# Altium schematic sheet 301_FrameUSB.SchDoc: Framework USB Expansion Ports
size A2; Organization: Greenfield Tech Solutions; Address1: Molendreef 33; Address2: Ossendrecht; Address3: 4641CS; Address4: The Netherlands; SheetNumber: 4; SheetTotal: 9
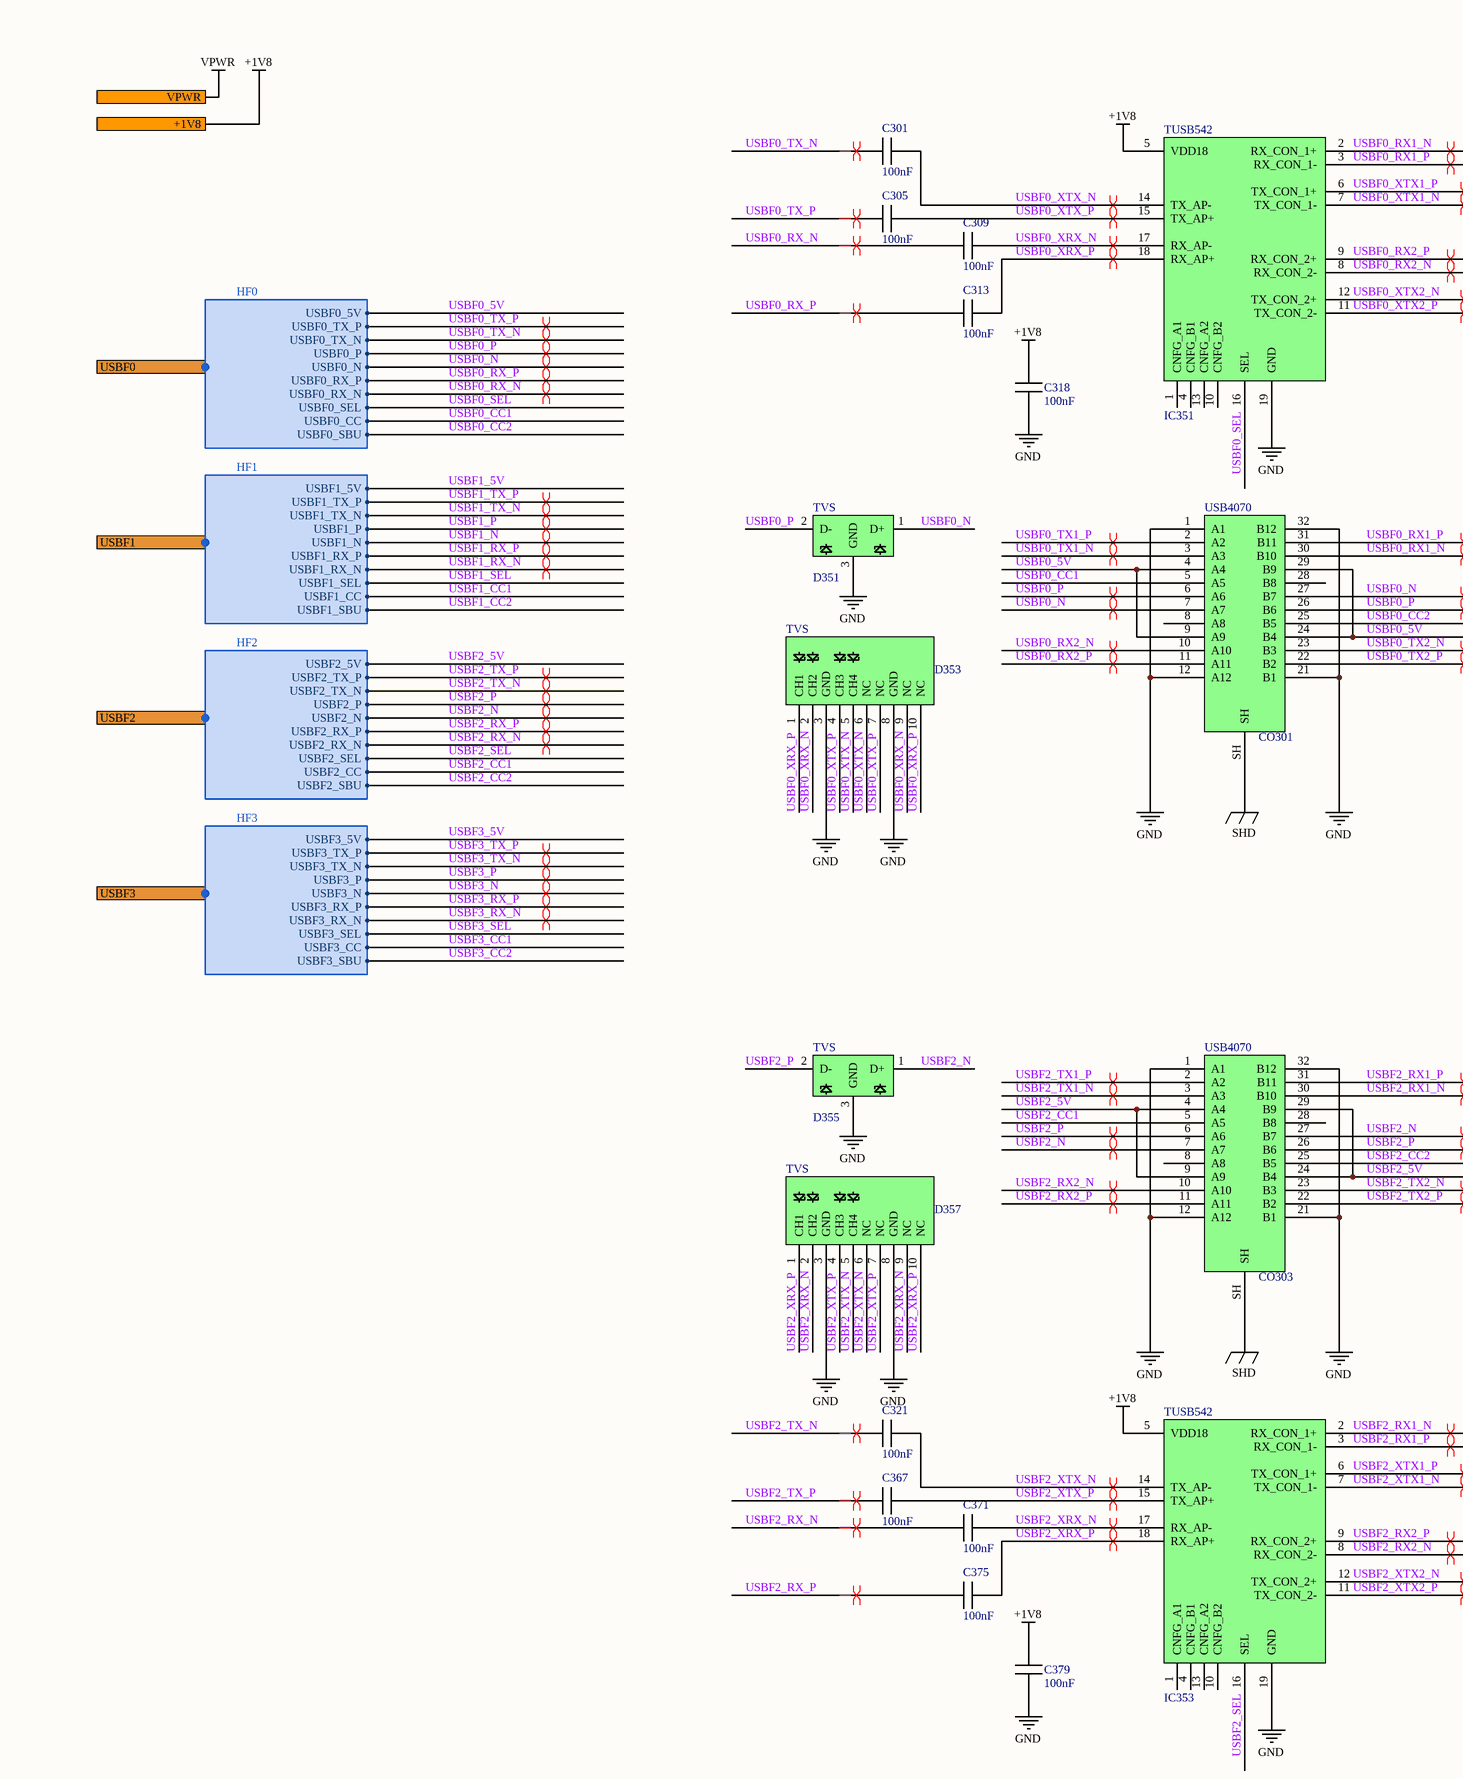
[diagram p0: 301_FrameUSB.SchDoc, top left]
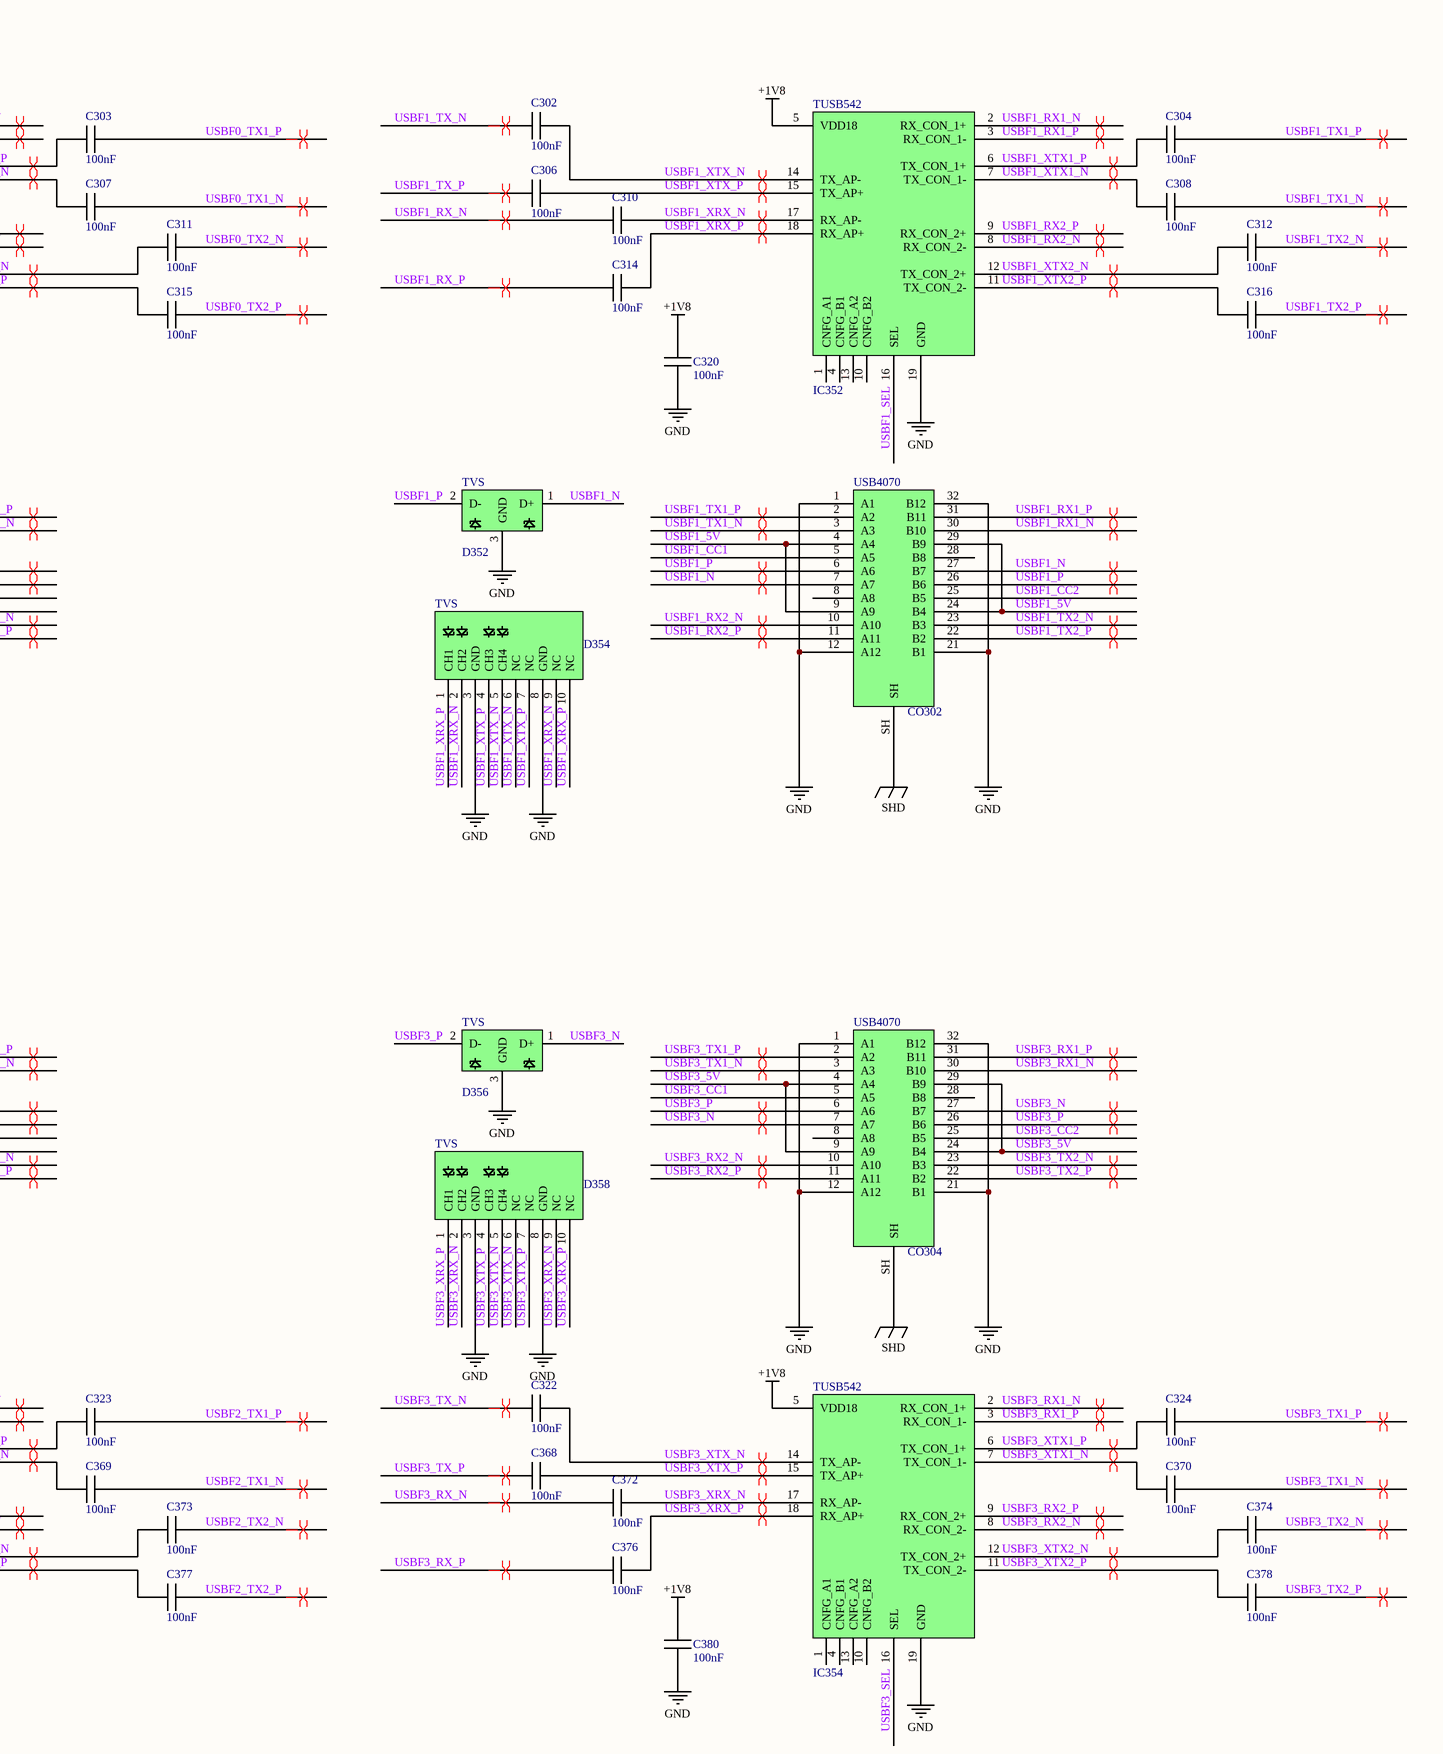
[diagram p1: 301_FrameUSB.SchDoc, top right]
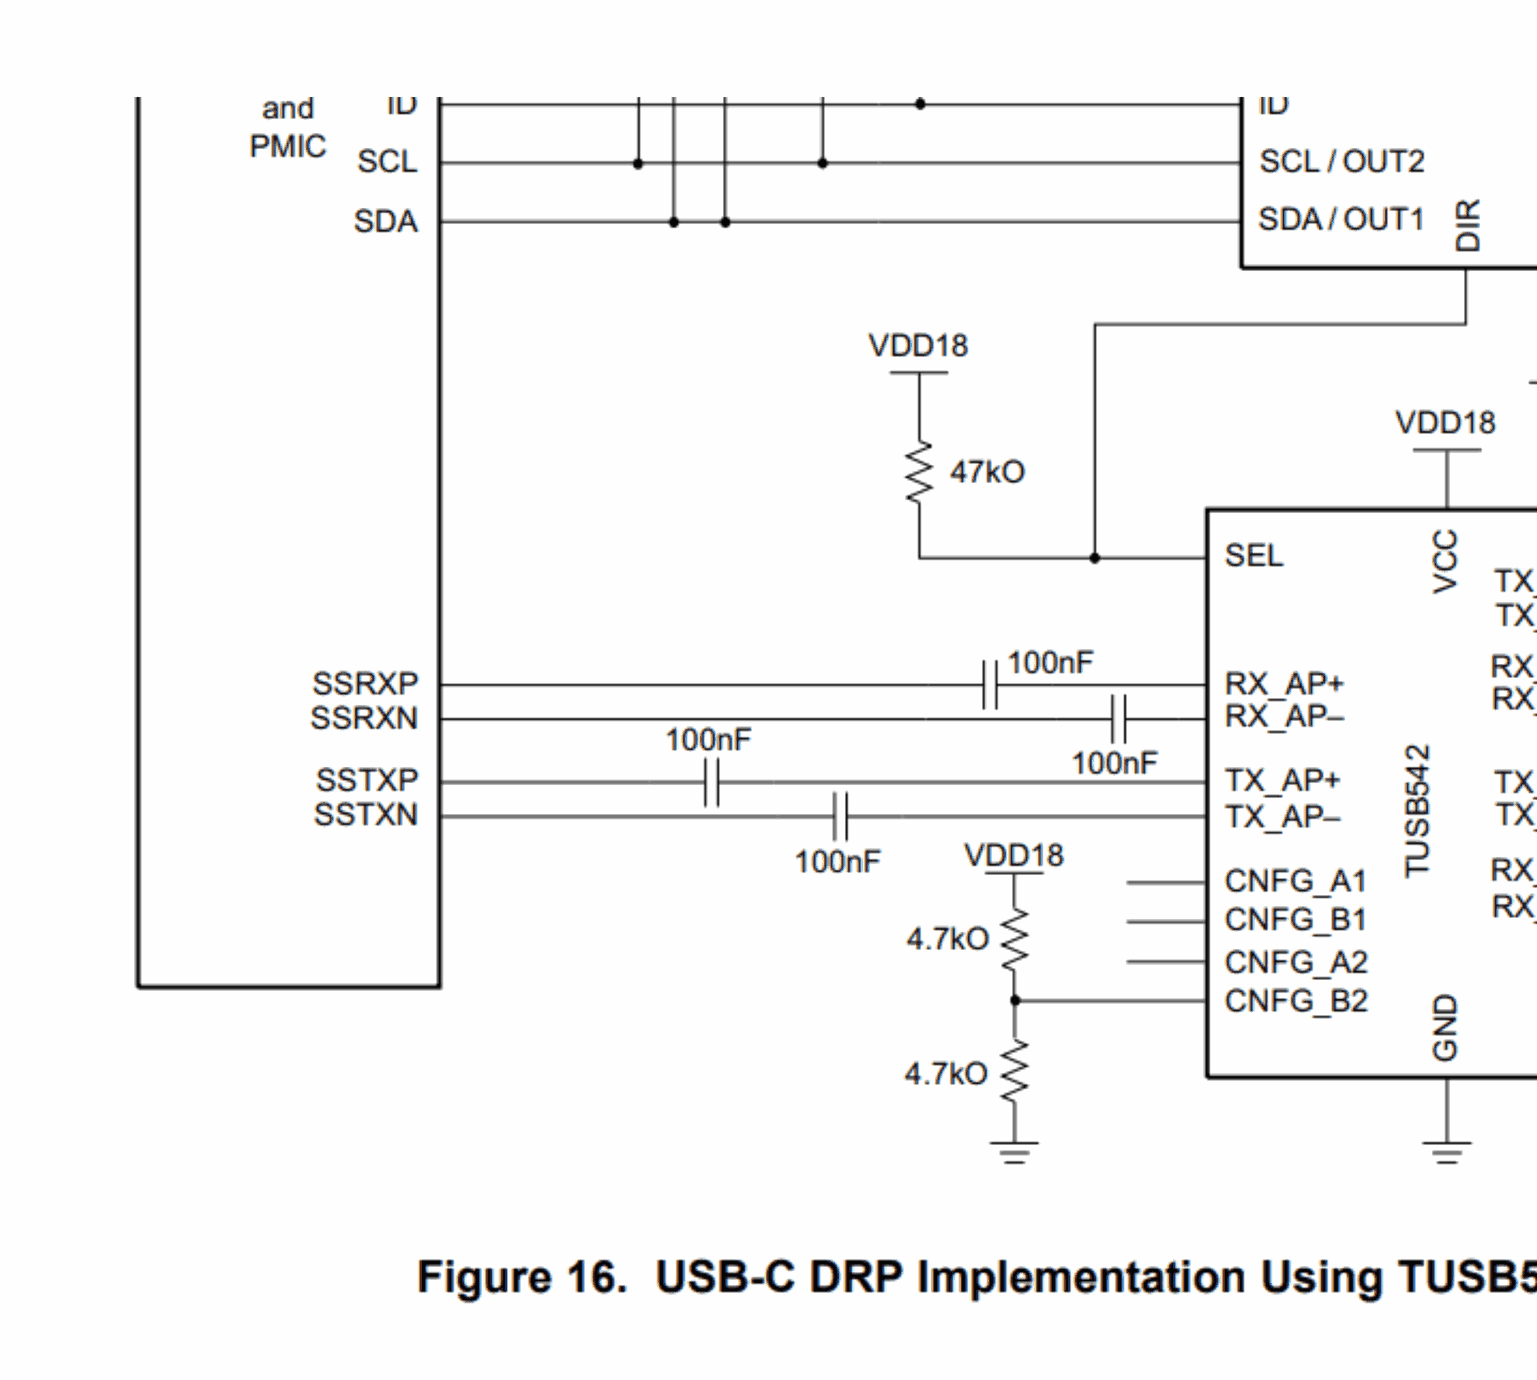
[diagram p2: 301_FrameUSB.SchDoc, bottom left]
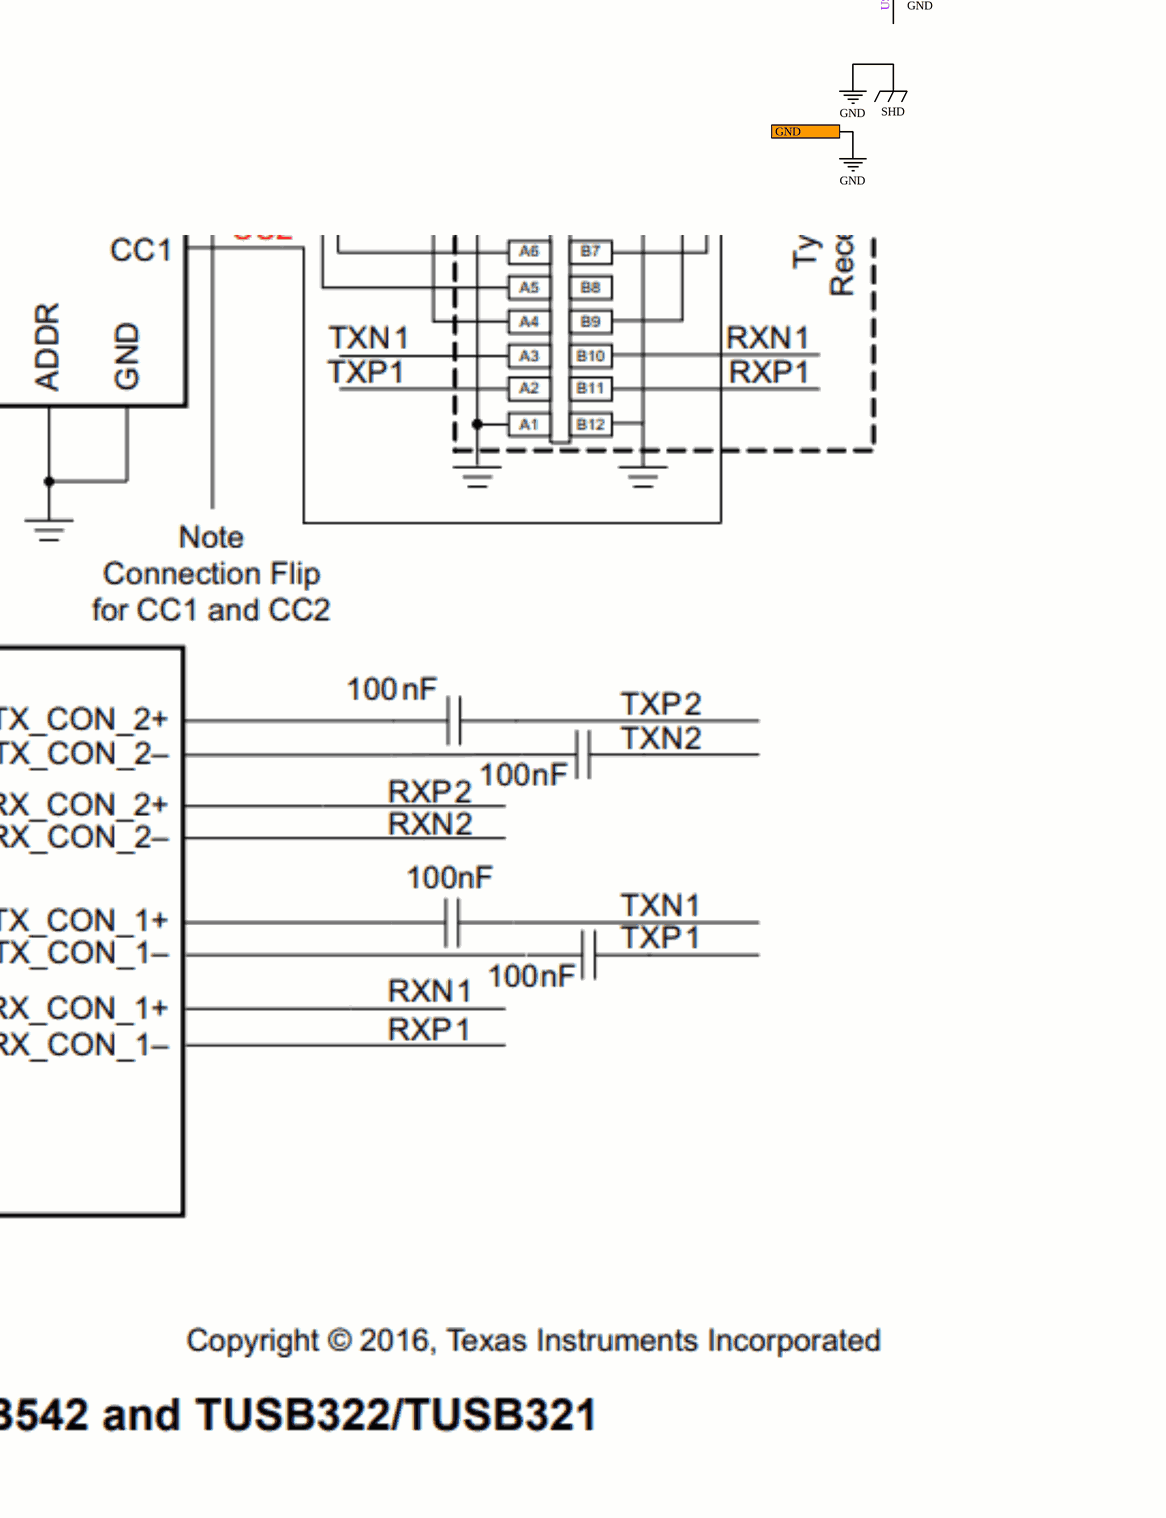
[diagram p3: 301_FrameUSB.SchDoc, bottom right]

## Parts
C301  100nF  [C0402]
C302  100nF  [C0402]
C303  100nF  [C0402]
C304  100nF  [C0402]
C305  100nF  [C0402]
C306  100nF  [C0402]
C307  100nF  [C0402]
C308  100nF  [C0402]
C309  100nF  [C0402]
C310  100nF  [C0402]
C311  100nF  [C0402]
C312  100nF  [C0402]
C313  100nF  [C0402]
C314  100nF  [C0402]
C315  100nF  [C0402]
C316  100nF  [C0402]
C318  100nF  [C0402]
C320  100nF  [C0402]
C321  100nF  [C0402]
C322  100nF  [C0402]
C323  100nF  [C0402]
C324  100nF  [C0402]
C367  100nF  [C0402]
C368  100nF  [C0402]
C369  100nF  [C0402]
C370  100nF  [C0402]
C371  100nF  [C0402]
C372  100nF  [C0402]
C373  100nF  [C0402]
C374  100nF  [C0402]
C375  100nF  [C0402]
C376  100nF  [C0402]
C377  100nF  [C0402]
C378  100nF  [C0402]
C379  100nF  [C0402]
C380  100nF  [C0402]
CO301  USB4070  [USB4070-30-C]
CO302  USB4070  [USB4070-30-C]
CO303  USB4070  [USB4070-30-C]
CO304  USB4070  [USB4070-30-C]
D351  TVS  [SOT-3]
D352  TVS  [SOT-3]
D353  TVS  [SOT-1176-1]
D354  TVS  [SOT-1176-1]
D355  TVS  [SOT-3]
D356  TVS  [SOT-3]
D357  TVS  [SOT-1176-1]
D358  TVS  [SOT-1176-1]
IC351  TUSB542  [X2QFN-18G_2.4X2]
IC352  TUSB542  [X2QFN-18G_2.4X2]
IC353  TUSB542  [X2QFN-18G_2.4X2]
IC354  TUSB542  [X2QFN-18G_2.4X2]

## Ports
+1V8, GND, USBF0 (harness HF0), USBF1 (harness HF1), USBF2 (harness HF2), USBF3 (harness HF3), VPWR

## Harnesses
HF0: USBF0_5V, USBF0_TX_P, USBF0_TX_N, USBF0_N, USBF0_RX_P, USBF0_RX_N, USBF0_SEL, USBF0_P, USBF0_CC, USBF0_SBU
HF1: USBF1_5V, USBF1_TX_P, USBF1_TX_N, USBF1_N, USBF1_RX_P, USBF1_RX_N, USBF1_SEL, USBF1_P, USBF1_CC, USBF1_SBU
HF2: USBF2_5V, USBF2_TX_P, USBF2_TX_N, USBF2_N, USBF2_RX_P, USBF2_RX_N, USBF2_SEL, USBF2_P, USBF2_CC, USBF2_SBU
HF3: USBF3_5V, USBF3_TX_P, USBF3_TX_N, USBF3_N, USBF3_RX_P, USBF3_RX_N, USBF3_SEL, USBF3_P, USBF3_CC, USBF3_SBU

## Nets
+1V8: C318.1 C320.1 C379.1 C380.1 IC351.5(VDD18) IC352.5(VDD18) IC353.5(VDD18) IC354.5(VDD18) ; port +1V8
GND: C318.2 C320.2 C379.2 C380.2 CO301.1(A1) CO301.12(A12) CO301.21(B1) CO301.32(B12) CO301.SH CO302.1(A1) CO302.12(A12) CO302.21(B1) CO302.32(B12) CO302.SH CO303.1(A1) CO303.12(A12) CO303.21(B1) CO303.32(B12) CO303.SH CO304.1(A1) CO304.12(A12) CO304.21(B1) CO304.32(B12) CO304.SH D351.3(GND) D352.3(GND) D353.3(GND) D353.8(GND) D354.3(GND) D354.8(GND) D355.3(GND) D356.3(GND) D357.3(GND) D357.8(GND) D358.3(GND) D358.8(GND) IC351.19(GND) IC352.19(GND) IC353.19(GND) IC354.19(GND) ; port GND  [also labelled SHD]
VPWR: port VPWR
USBF0_5V: CO301.4(A4) CO301.9(A9) CO301.24(B4) CO301.29(B9) ; port USBF0.USBF0_5V
USBF0_CC1: CO301.5(A5) ; port USBF0.USBF0_CC
USBF0_CC2: CO301.25(B5) ; port USBF0.USBF0_SBU
USBF0_N: CO301.7(A7) CO301.27(B7) D351.1(D+) ; port USBF0.USBF0_N
USBF0_P: CO301.6(A6) CO301.26(B6) D351.2(D-) ; port USBF0.USBF0_P
USBF0_RX1_N: CO301.30(B10) IC351.2(RX_CON_1+)
USBF0_RX1_P: CO301.31(B11) IC351.3(RX_CON_1-)
USBF0_RX2_N: CO301.10(A10) IC351.8(RX_CON_2-)
USBF0_RX2_P: CO301.11(A11) IC351.9(RX_CON_2+)
USBF0_RX_N: C309.1 ; port USBF0.USBF0_RX_N
USBF0_RX_P: C313.1 ; port USBF0.USBF0_RX_P
USBF0_SEL: IC351.16(SEL) ; port USBF0.USBF0_SEL
USBF0_TX1_N: C307.2 CO301.3(A3)
USBF0_TX1_P: C303.2 CO301.2(A2)
USBF0_TX2_N: C311.2 CO301.23(B3)
USBF0_TX2_P: C315.2 CO301.22(B2)
USBF0_TX_N: C301.1 ; port USBF0.USBF0_TX_N
USBF0_TX_P: C305.1 ; port USBF0.USBF0_TX_P
USBF0_XRX_N: C309.2 D353.2(CH2) D353.9(NC) IC351.17(RX_AP-)
USBF0_XRX_P: C313.2 D353.1(CH1) D353.10(NC) IC351.18(RX_AP+)
USBF0_XTX1_N: C307.1 IC351.7(TX_CON_1-)
USBF0_XTX1_P: C303.1 IC351.6(TX_CON_1+)
USBF0_XTX2_N: C311.1 IC351.12(TX_CON_2+)
USBF0_XTX2_P: C315.1 IC351.11(TX_CON_2-)
USBF0_XTX_N: C301.2 D353.5(CH4) D353.6(NC) IC351.14(TX_AP-)
USBF0_XTX_P: C305.2 D353.4(CH3) D353.7(NC) IC351.15(TX_AP+)
USBF1_5V: CO302.4(A4) CO302.9(A9) CO302.24(B4) CO302.29(B9) ; port USBF1.USBF1_5V
USBF1_CC1: CO302.5(A5) ; port USBF1.USBF1_CC
USBF1_CC2: CO302.25(B5) ; port USBF1.USBF1_SBU
USBF1_N: CO302.7(A7) CO302.27(B7) D352.1(D+) ; port USBF1.USBF1_N
USBF1_P: CO302.6(A6) CO302.26(B6) D352.2(D-) ; port USBF1.USBF1_P
USBF1_RX1_N: CO302.30(B10) IC352.2(RX_CON_1+)
USBF1_RX1_P: CO302.31(B11) IC352.3(RX_CON_1-)
USBF1_RX2_N: CO302.10(A10) IC352.8(RX_CON_2-)
USBF1_RX2_P: CO302.11(A11) IC352.9(RX_CON_2+)
USBF1_RX_N: C310.1 ; port USBF1.USBF1_RX_N
USBF1_RX_P: C314.1 ; port USBF1.USBF1_RX_P
USBF1_SEL: IC352.16(SEL) ; port USBF1.USBF1_SEL
USBF1_TX1_N: C308.2 CO302.3(A3)
USBF1_TX1_P: C304.2 CO302.2(A2)
USBF1_TX2_N: C312.2 CO302.23(B3)
USBF1_TX2_P: C316.2 CO302.22(B2)
USBF1_TX_N: C302.1 ; port USBF1.USBF1_TX_N
USBF1_TX_P: C306.1 ; port USBF1.USBF1_TX_P
USBF1_XRX_N: C310.2 D354.2(CH2) D354.9(NC) IC352.17(RX_AP-)
USBF1_XRX_P: C314.2 D354.1(CH1) D354.10(NC) IC352.18(RX_AP+)
USBF1_XTX1_N: C308.1 IC352.7(TX_CON_1-)
USBF1_XTX1_P: C304.1 IC352.6(TX_CON_1+)
USBF1_XTX2_N: C312.1 IC352.12(TX_CON_2+)
USBF1_XTX2_P: C316.1 IC352.11(TX_CON_2-)
USBF1_XTX_N: C302.2 D354.5(CH4) D354.6(NC) IC352.14(TX_AP-)
USBF1_XTX_P: C306.2 D354.4(CH3) D354.7(NC) IC352.15(TX_AP+)
USBF2_5V: CO303.4(A4) CO303.9(A9) CO303.24(B4) CO303.29(B9) ; port USBF2.USBF2_5V
USBF2_CC1: CO303.5(A5) ; port USBF2.USBF2_CC
USBF2_CC2: CO303.25(B5) ; port USBF2.USBF2_SBU
USBF2_N: CO303.7(A7) CO303.27(B7) D355.1(D+) ; port USBF2.USBF2_N
USBF2_P: CO303.6(A6) CO303.26(B6) D355.2(D-) ; port USBF2.USBF2_P
USBF2_RX1_N: CO303.30(B10) IC353.2(RX_CON_1+)
USBF2_RX1_P: CO303.31(B11) IC353.3(RX_CON_1-)
USBF2_RX2_N: CO303.10(A10) IC353.8(RX_CON_2-)
USBF2_RX2_P: CO303.11(A11) IC353.9(RX_CON_2+)
USBF2_RX_N: C371.1 ; port USBF2.USBF2_RX_N
USBF2_RX_P: C375.1 ; port USBF2.USBF2_RX_P
USBF2_SEL: IC353.16(SEL) ; port USBF2.USBF2_SEL
USBF2_TX1_N: C369.2 CO303.3(A3)
USBF2_TX1_P: C323.2 CO303.2(A2)
USBF2_TX2_N: C373.2 CO303.23(B3)
USBF2_TX2_P: C377.2 CO303.22(B2)
USBF2_TX_N: C321.1 ; port USBF2.USBF2_TX_N
USBF2_TX_P: C367.1 ; port USBF2.USBF2_TX_P
USBF2_XRX_N: C371.2 D357.2(CH2) D357.9(NC) IC353.17(RX_AP-)
USBF2_XRX_P: C375.2 D357.1(CH1) D357.10(NC) IC353.18(RX_AP+)
USBF2_XTX1_N: C369.1 IC353.7(TX_CON_1-)
USBF2_XTX1_P: C323.1 IC353.6(TX_CON_1+)
USBF2_XTX2_N: C373.1 IC353.12(TX_CON_2+)
USBF2_XTX2_P: C377.1 IC353.11(TX_CON_2-)
USBF2_XTX_N: C321.2 D357.5(CH4) D357.6(NC) IC353.14(TX_AP-)
USBF2_XTX_P: C367.2 D357.4(CH3) D357.7(NC) IC353.15(TX_AP+)
USBF3_5V: CO304.4(A4) CO304.9(A9) CO304.24(B4) CO304.29(B9) ; port USBF3.USBF3_5V
USBF3_CC1: CO304.5(A5) ; port USBF3.USBF3_CC
USBF3_CC2: CO304.25(B5) ; port USBF3.USBF3_SBU
USBF3_N: CO304.7(A7) CO304.27(B7) D356.1(D+) ; port USBF3.USBF3_N
USBF3_P: CO304.6(A6) CO304.26(B6) D356.2(D-) ; port USBF3.USBF3_P
USBF3_RX1_N: CO304.30(B10) IC354.2(RX_CON_1+)
USBF3_RX1_P: CO304.31(B11) IC354.3(RX_CON_1-)
USBF3_RX2_N: CO304.10(A10) IC354.8(RX_CON_2-)
USBF3_RX2_P: CO304.11(A11) IC354.9(RX_CON_2+)
USBF3_RX_N: C372.1 ; port USBF3.USBF3_RX_N
USBF3_RX_P: C376.1 ; port USBF3.USBF3_RX_P
USBF3_SEL: IC354.16(SEL) ; port USBF3.USBF3_SEL
USBF3_TX1_N: C370.2 CO304.3(A3)
USBF3_TX1_P: C324.2 CO304.2(A2)
USBF3_TX2_N: C374.2 CO304.23(B3)
USBF3_TX2_P: C378.2 CO304.22(B2)
USBF3_TX_N: C322.1 ; port USBF3.USBF3_TX_N
USBF3_TX_P: C368.1 ; port USBF3.USBF3_TX_P
USBF3_XRX_N: C372.2 D358.2(CH2) D358.9(NC) IC354.17(RX_AP-)
USBF3_XRX_P: C376.2 D358.1(CH1) D358.10(NC) IC354.18(RX_AP+)
USBF3_XTX1_N: C370.1 IC354.7(TX_CON_1-)
USBF3_XTX1_P: C324.1 IC354.6(TX_CON_1+)
USBF3_XTX2_N: C374.1 IC354.12(TX_CON_2+)
USBF3_XTX2_P: C378.1 IC354.11(TX_CON_2-)
USBF3_XTX_N: C322.2 D358.5(CH4) D358.6(NC) IC354.14(TX_AP-)
USBF3_XTX_P: C368.2 D358.4(CH3) D358.7(NC) IC354.15(TX_AP+)

Not connected (* = marked no-connect by the designer): CO301 8(A8) 28(B8); CO302 8(A8) 28(B8); CO303 8(A8) 28(B8); CO304 8(A8) 28(B8); IC351 1(CNFG_A1) 4(CNFG_B1) 10(CNFG_B2) 13(CNFG_A2); IC352 1(CNFG_A1) 4(CNFG_B1) 10(CNFG_B2) 13(CNFG_A2); IC353 1(CNFG_A1) 4(CNFG_B1) 10(CNFG_B2) 13(CNFG_A2); IC354 1(CNFG_A1) 4(CNFG_B1) 10(CNFG_B2) 13(CNFG_A2)

## Layout directives
differential pair; differential pair class USB3: USBF0_N, USBF0_P, USBF0_RX1_N, USBF0_RX1_P, USBF0_RX2_N, USBF0_RX2_P, USBF0_RX_N, USBF0_RX_P, USBF0_TX1_N, USBF0_TX1_P, USBF0_TX2_N, USBF0_TX2_P, USBF0_TX_N, USBF0_TX_P, USBF0_XRX_N, USBF0_XRX_P, USBF0_XTX1_N, USBF0_XTX1_P, USBF0_XTX2_N, USBF0_XTX2_P, USBF0_XTX_N, USBF0_XTX_P, USBF1_N, USBF1_P, USBF1_RX1_N, USBF1_RX1_P, USBF1_RX2_N, USBF1_RX2_P, USBF1_RX_N, USBF1_RX_P, USBF1_TX1_N, USBF1_TX1_P, USBF1_TX2_N, USBF1_TX2_P, USBF1_TX_N, USBF1_TX_P, USBF1_XRX_N, USBF1_XRX_P, USBF1_XTX1_N, USBF1_XTX1_P, USBF1_XTX2_N, USBF1_XTX2_P, USBF1_XTX_N, USBF1_XTX_P, USBF2_N, USBF2_P, USBF2_RX1_N, USBF2_RX1_P, USBF2_RX2_N, USBF2_RX2_P, USBF2_RX_N, USBF2_RX_P, USBF2_TX1_N, USBF2_TX1_P, USBF2_TX2_N, USBF2_TX2_P, USBF2_TX_N, USBF2_TX_P, USBF2_XRX_N, USBF2_XRX_P, USBF2_XTX1_N, USBF2_XTX1_P, USBF2_XTX2_N, USBF2_XTX2_P, USBF2_XTX_N, USBF2_XTX_P, USBF3_N, USBF3_P, USBF3_RX1_N, USBF3_RX1_P, USBF3_RX2_N, USBF3_RX2_P, USBF3_RX_N, USBF3_RX_P, USBF3_TX1_N, USBF3_TX1_P, USBF3_TX2_N, USBF3_TX2_P, USBF3_TX_N, USBF3_TX_P, USBF3_XRX_N, USBF3_XRX_P, USBF3_XTX1_N, USBF3_XTX1_P, USBF3_XTX2_N, USBF3_XTX2_P, USBF3_XTX_N, USBF3_XTX_P

## Notes on the sheet
- Title
- Size:
- Date:
- File:
- A2
- Number:
- Time:
- Revision:
- Sheet
- of

## Library data of the parts
C301-C316 C318 C320-C324 C367-C380 = CA0010: 100nF 16V 10% X7R; Part Number: CA0010; ManfactPart: GCM155R71C104KA55D; ID: 10; RefVal: 100nF
CO301-CO304 = CO0021: USB C connector Receptacle Vertical; Part Number: CO0021; ID: 16; RefVal: USB4070; ManfactPart: USB4070-30-C
D351 D352 D355 D356 = DI0002: USB 2 TVS Diode; Part Number: DI0002; ManfactPart: TPD2EUSB30DRTR; ID: 2; RefVal: TVS
D353 D354 D357 D358 = DI0007: USB 3 TVS Diode; Part Number: DI0007; ManfactPart: PUSB3FA2Z; ID: 7; RefVal: TVS
IC351-IC354 = IC0039: TUSB542 USB Type-C 5 Gbps Redriver 2:1 MUX; Part Number: IC0039; ID: 39; RefVal: TUSB542; ManfactPart: TUSB542